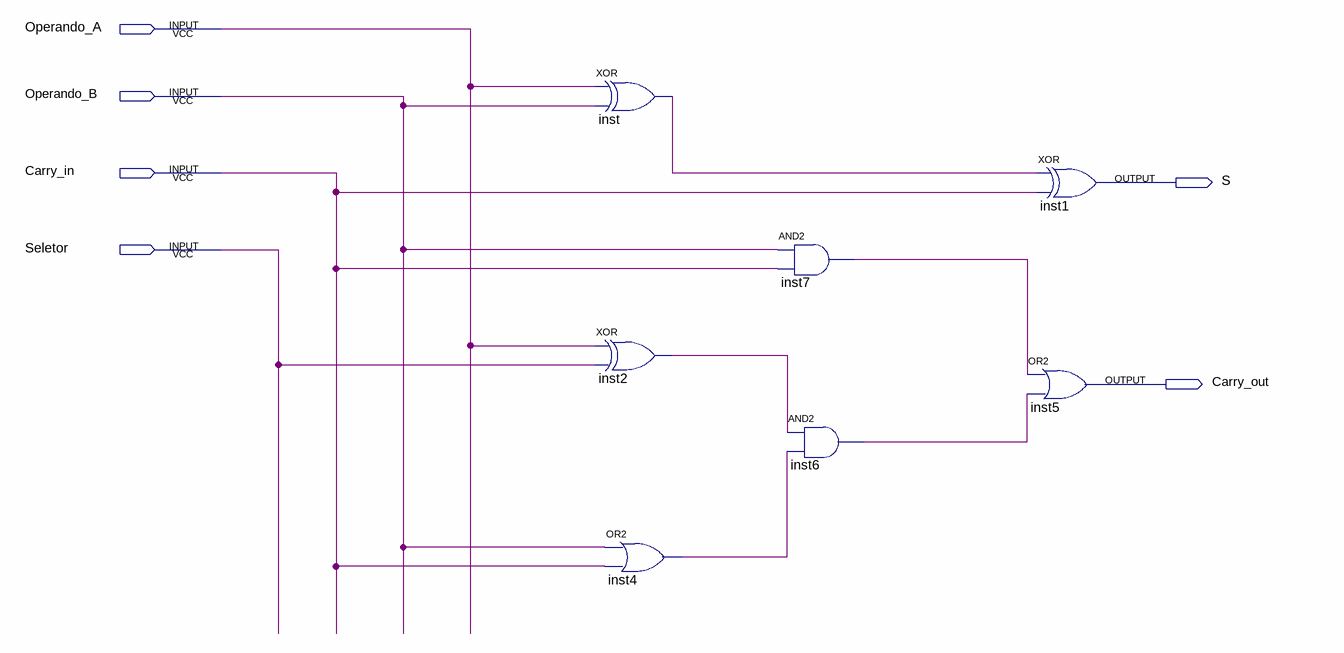
[diagram p0: schematic sheet]
// Quartus schematic Adder_Subtractor.bdf as structural Verilog: 7 symbols, 6 pins
module Adder_Subtractor (
  input  Operando_A,
  input  Operando_B,
  input  Carry_in,
  input  Seletor,
  output S,
  output Carry_out
);

  wire inst2_out, inst4_out, inst6_out, inst7_out, inst_out;

  xor inst (inst_out, Operando_A, Operando_B);
  xor inst2 (inst2_out, Operando_A, Seletor);
  or inst4 (inst4_out, Operando_B, Carry_in);
  and inst7 (inst7_out, Operando_B, Carry_in);
  and inst6 (inst6_out, inst2_out, inst4_out);
  xor inst1 (S, inst_out, Carry_in);
  or inst5 (Carry_out, inst7_out, inst6_out);
endmodule
